# EAGLE design V3.0 (EAGLE 6.1)
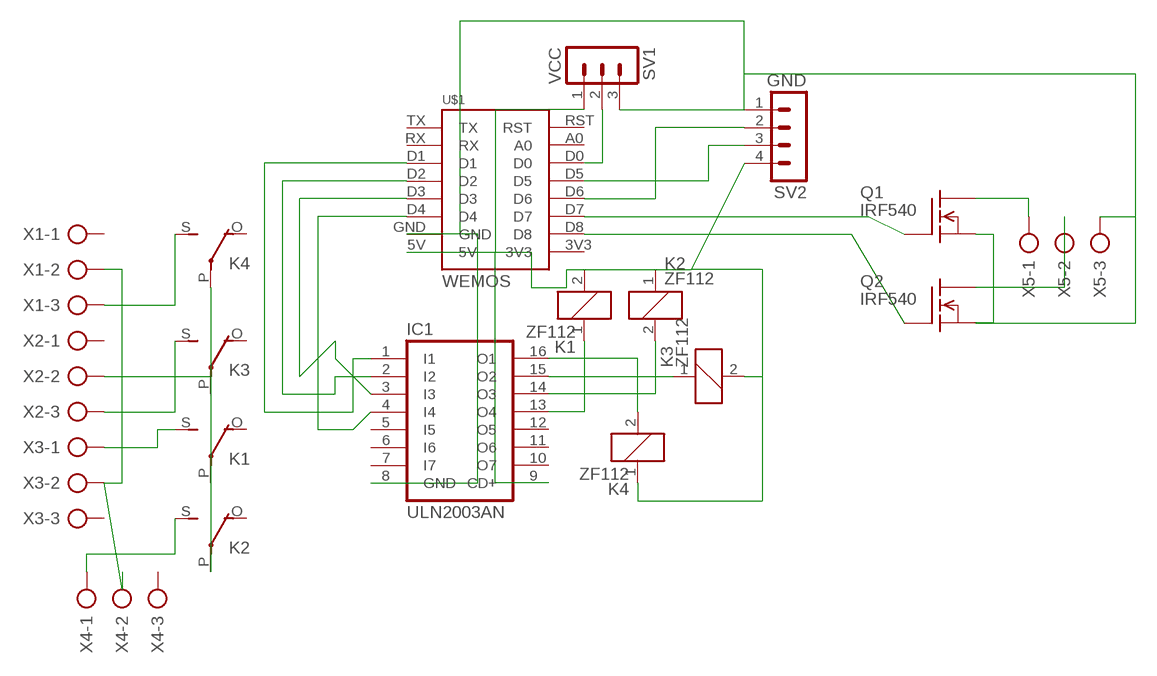
[diagram p0: schematic, sheet 1]

## Parts
IC1  ULN2003AN  [DIL16]
K1  ZF112  [ZF112]
K2  ZF112  [ZF112]
K3  ZF112  [ZF112]
K4  ZF112  [ZF112]
Q1  IRF540  [TO220]
Q2  IRF540  [TO220]
SV1  VCC  MA03-1  [MA03-1]
SV2  GND  MA04-1  [MA04-1]
U$1  WEMOS  [WEMOS]
X1  AK300/3  [AK300/3]
X2  AK300/3  [AK300/3]
X3  AK300/3  [AK300/3]
X4  AK300/3  [AK300/3]
X5  AK300/3  [AK300/3]

## Nets
N$1: IC1.1(I1) U$1.D1
N$2: IC1.2(I2) U$1.D2
N$3: IC1.3(I3) U$1.D3
N$4: IC1.4(I4) U$1.D4
N$5: IC1.8(GND) Q1.3(S) Q2.3(S) SV1.3 SV2.1 U$1.GND X5.3
N$6: IC1.9(CD+) K1.2 K2.1 K3.2 K4.1 SV1.1 SV2.4 U$1.5V
N$7: IC1.15(O2) K3.1
N$8: IC1.13(O4) K1.1
N$9: IC1.14(O3) K2.2
N$10: IC1.16(O1) K4.2
N$12: K4.S(2:S) X1.3
N$13: K3.S(2:S) X2.3
N$14: K1.S(2:S) X3.1
N$15: K2.S(2:S) X4.1
N$16: K1.P(2:P) K2.P(2:P) K3.P(2:P) K4.P(2:P) X1.2 X2.2 X3.2 X4.2
N$17: SV1.2 U$1.D0
N$19: SV2.3 U$1.D5
N$20: SV2.2 U$1.D6
N$21: Q1.1(G) U$1.D7
N$22: Q2.1(G) U$1.D8
N$24: Q1.2(D) X5.1
N$25: Q2.2(D) X5.2
Unconnected: IC1.5(I5) IC1.6(I6) IC1.7(I7) IC1.10(O7) IC1.11(O6) IC1.12(O5) K1.O(2:O) K2.O(2:O) K3.O(2:O) K4.O(2:O) U$1.3V3 U$1.A0 U$1.RST U$1.RX U$1.TX X1.1 X2.1 X3.3 X4.3

## Library data of the parts
IC1 = uln-udn:ULN2003A: DRIVER ARRAY
K1-K4 = relay:ZF112: RELAY 1 x switch; OC_FARNELL: unknown; OC_NEWARK: unknown
Q1 Q2 = transistor-fet:IRF540: N-Channel Enhancement MOSFET (HEXFET); 100V; 28A; 0,077Ohm
SV1 = con-lstb:MA03-1: PIN HEADER; OC_FARNELL: unknown; OC_NEWARK: unknown
SV2 = con-lstb:MA04-1: PIN HEADER; OC_FARNELL: unknown; OC_NEWARK: unknown
U$1 = Wemos:WEMOS
X1-X5 = con-ptr500:AK300/3: CONNECTOR; OC_FARNELL: unknown; OC_NEWARK: unknown

## Board
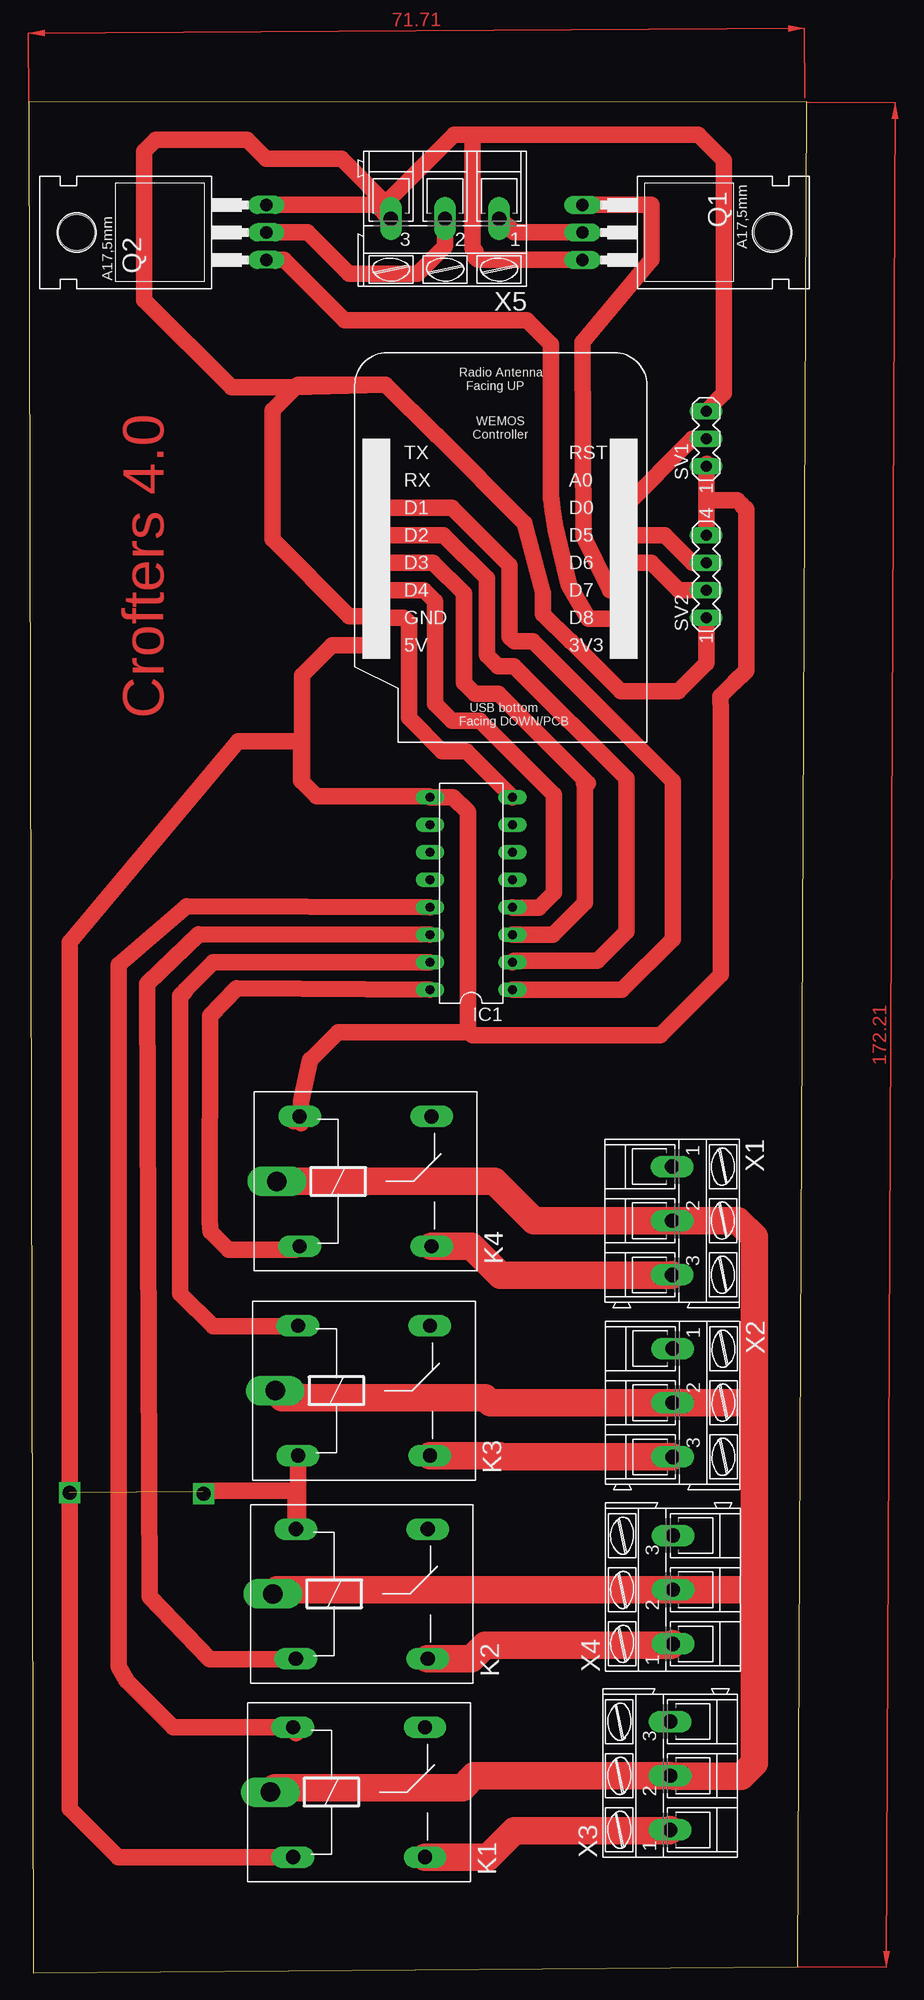
[diagram p1: board, top side]

Size 71.86 x 172.82 mm. Coordinates in mm from the lower left corner, seen from the top.
Outline: 0.38,0 71.05,0.56 71.86,172.82 0,172.75 0.38,0
Copper layers (1*16): Top 0.035mm / dielectric 1.5mm / Bottom 0.035mm
Design rules: minimum track width 60mil, minimum drill 24mil, track to track 20mil, track to pad 25mil, pad to pad 8mil, via to via 8mil, smd to smd 8mil, copper to edge 40mil, drill to drill 8mil, minimum pad ring 10mil, minimum via ring 8mil, stop-mask expansion 4mil, vias tented up to drill 0mil, thermal gap 10mil

### Footprints (pad centres in the part's own frame; a part is rotated, then mirrored left to right if it is on the bottom)
DIL16 = drill 0.813 long: 1 -8.89,-3.81; 2 -6.35,-3.81; 3 -3.81,-3.81; 4 -1.27,-3.81; 5 1.27,-3.81; 6 3.81,-3.81; 7 6.35,-3.81; 8 8.89,-3.81; 9 8.89,3.81; 10 6.35,3.81; 11 3.81,3.81; 12 1.27,3.81; 13 -1.27,3.81; 14 -3.81,3.81; 15 -6.35,3.81; 16 -8.89,3.81
ZF112 = drill 1.321 long: 1 -6.096,5.994; 2 -6.096,-5.994; O 6.096,5.994; S 6.096,-5.994 | drill 1.803 long: P -8.204,0
TO220 = drill 1.118 long: 1 -2.54,-6.35; 2 0,-6.35; 3 2.54,-6.35 | hole 3.302: 0,11.176
MA03-1 = drill 1.016 long: 1 -2.54,0; 2 0,0; 3 2.54,0
MA04-1 = drill 1.016 long: 1 -3.81,0; 2 -1.27,0; 3 1.27,0; 4 3.81,0
WEMOS = drill 0.8 octagon: 3V3 22.86,0; 5V 0,0; A0 22.86,15.24; D0 22.86,12.7; D1 0,12.7; D2 0,10.16; D3 0,7.62; D4 0,5.08; D5 22.86,10.16; D6 22.86,7.62; D7 22.86,5.08; D8 22.86,2.54; GND 0,2.54; RST 22.86,17.78; RX 0,15.24; TX 0,17.78
AK300/3 = drill 1.321 long: 1 -5.004,0; 2 0,0; 3 5.004,0

### Placement (x,y rotation side)
IC1  40.87,99.69 90 top
K1  30.51,16.69 0 top
K2  30.76,35 0 top
K3  30.96,53.77 0 top
K4  31.11,73.1 0 top
Q1  57.51,160.73 270 top
Q2  15.6,160.73 90 top
SV1  62.59,141.68 90 top
SV2  62.59,128.98 90 top
U$1  32.11,122.63 0 top
X1  59.44,69.47 270 top
X2  59.49,52.65 270 top
X3  59.26,18.21 90 top
X4  59.51,35.38 90 top
X5  38.46,162 180 top

### Tracks (layer width: path | path; a pad name or v marks a point on that pad's centre or on a via)
N$1
  Top 1.524: U$1.D1 39.09,135.33 44.42,130 44.42,123.39 44.86,122.96 46.56,122.96 59.49,110.03 59.49,95.48 54.81,90.8 IC1.1
N$2
  Top 1.524: U$1.D2 38.33,132.79 42.34,128.78 42.34,121.69 43.36,120.68 44.83,120.68 55.19,110.31 55.19,96.14 52.55,93.5 44.83,93.5 IC1.2
N$3
  Top 1.524: U$1.D3 37.36,130.25 40.18,127.43 40.18,119.15 41.2,118.14 43.41,118.14 51.66,109.88 51.64,109.85 51.61,109.88 51.31,109.88 51.38,109.8 51.46,109.88 51.49,109.88 51.38,109.78 51.38,98.83 48.44,95.88 IC1.3
N$4
  Top 1.524: U$1.D4 36.52,127.71 37.54,126.7 37.54,117.2 39.12,115.62 41.68,115.62 48.51,108.79 48.51,99.75 47.14,98.37 44.73,98.37 IC1.4
N$5
  Top 1.524: Q2.3 32.11,163.27 33.38,162 X5.3 | 62.71,125.04 SV2.1 62.59,120.95 59.99,118.36 54.69,118.36 50.09,122.96 50.04,122.96 47.52,125.48 47.52,127.46 45.8,133.88 37.69,141.99 37.64,141.99 32.94,146.68 | IC1.8 40.44,112.83 38.18,112.83 35.1,115.9 35.1,124.69 34.62,125.17 U$1.GND 32.41,124.87 32.51,124.87 32.46,124.82 32.31,124.82 31.83,125.3 29.59,125.3 22.5,132.38 22.5,144.32 24.87,146.68 32.94,146.68 | 32.94,146.68 24.41,146.43 18.72,146.43 10.67,154.48 10.67,168.25 11.73,169.32 20.14,169.32 21.92,167.54 28.88,167.54 33.71,162.71 33.71,162.26 X5.3 | X5.3 33.45,163.93 39.29,169.77 41.35,169.77 | 41.35,169.77 61.87,169.77 64.24,167.41 64.24,145.87 SV1.3 | Q1.3 41.5,158.19 41.27,158.42 41.27,158.98 40.97,159.28 40.97,169.39 41.35,169.77
N$6  (via drill 1.3)  (1 unrouted)
  Top 1.524: 24.46,78.66 24.99,78.66 25.17,78.49 25.17,78.94 | 25.17,78.94 K4.1 | SV2.4 62.59,135.89 | 62.59,135.89 62.59,138.84 62.61,138.86 62.61,139.17 | 62.66,139.4 62.61,139.34 62.61,139.17 | U$1.5V 28.02,122.63 25.22,119.84 25.22,110.01 | 25.22,110.01 26.57,108.66 36.98,108.66 IC1.9 39.19,108.58 40.56,107.21 40.56,87.02 40.69,86.89 | 40.69,86.89 40.97,86.61 58.34,86.61 63.93,92.2 63.93,116.46 63.88,117.91 65.15,119.13 66.29,120.27 66.29,135.15 65.89,135.56 65.89,135.59 65.46,136.02 62.71,136.02 62.59,135.89 | K1.2 8.25,10.69 3.78,15.16 v3.78,44.35 3.78,95.17 19.35,113.74 24.94,113.74 | 24.94,113.74 25.15,113.94 | 25.17,78.94 25.17,80.52 25.98,84.33 26.01,84.33 28.57,86.89 40.69,86.89 | K3.2 24.87,41.2 K2.1 24.66,44.48 24.71,44.53 16.15,44.53 16.05,44.42 | 24.94,113.74 24.94,113.77 25.07,113.77 25.07,113.64 25.09,113.64 25.15,113.69 25.15,110.19 25.27,110.06 25.25,110.06 | 25.25,110.06 25.22,110.06 25.17,110.11 25.2,110.11 25.25,110.06 | 25.25,110.06 25.25,110.03 25.27,110.01 25.22,110.01 | 62.61,139.17 SV1.1
N$7
  Top 1.524: IC1.15 17.02,93.34 14.43,90.75 14.43,90.65 14,90.22 14,62.74 17.02,59.72 24.92,59.72 24.97,59.77 | K3.1 24.97,59.77 | 24.97,59.77 25.02,59.82
N$8
  Top 1.524: IC1.13 14.58,98.5 8.28,93.09 8.28,28.27 9.04,26.97 13.33,22.68 24.16,22.68 24.69,22.15 24.69,22.4 K1.1
N$9
  Top 1.524: IC1.14 15.7,95.91 10.92,91.36 11.15,34.75 16.69,28.98 24.64,28.98 K2.2
N$10
  Top 1.524: K4.2 24.69,66.78 18.47,66.78 16.8,68.44 16.71,69.42 16.74,88.39 19.2,90.96 IC1.16
N$11  (via drill 1.3)
  other vias: 16.15,44.25
N$12
  Top 2.54: K4.S 40.92,67.11 43.59,64.44 59.41,64.44 X1.3
N$13
  Top 1.524: X2.3 58.98,47.65
  Top 2.54: K3.S 43.54,47.78 43.66,47.65 58.98,47.65 59.41,47.65
N$14
  Top 2.54: K1.S 42.44,10.69 44.88,13.13 59.18,13.13 X3.1
N$15
  Top 2.54: K2.S 40.92,29.01 42.16,30.25 59.38,30.25 X4.1
N$16
  Top 1.524: 59.61,18.16 59.38,17.93 59.38,18.16 59.36,18.19 | 59.33,18.21 59.13,18.41 59.13,18.21 | 59.28,18.21 59.33,18.21 | 59.33,18.21 59.36,18.19 | 59.36,18.19 59.31,18.19 59.28,18.21 | 59.28,18.21 X3.2
  Top 2.54: K4.P 22.94,73.13 43.03,73.13 46.68,69.47 X1.2 65.53,69.47 67.03,67.97 67.03,52.68 | K3.P 23.39,53.14 42.16,53.14 42.65,52.65 X2.2 67,52.65 67.03,52.68 | K2.P 22.94,35.38 X4.2 66.98,35.38 67.03,35.33 | X3.2 59.23,18.21 59.13,18.21 41.15,18.21 40.06,17.12 22.73,17.12 K1.P | 67.03,52.68 67.03,35.33 | 67.03,35.33 67.03,19.35 65.84,18.16 59.61,18.16
N$17
  Top 1.524: U$1.D0 61.32,141.68 SV1.2
N$19
  Top 1.524: U$1.D5 58.78,132.79 61.32,130.25 SV2.3
N$20
  Top 1.524: U$1.D6 57.51,130.25 60.05,127.71 SV2.2
N$21
  Top 1.524: U$1.D7 53.7,127.71 51.23,132.66 51.16,150.57 57.51,158.19 57.51,163.27 Q1.1
N$22
  Top 1.524: Q2.1 23.6,158.19 29.16,152.63 46.02,152.63 48.26,150.39 48.26,136.22 48.29,136.04 48.36,135.15 48.67,133.4 49.89,128.14 51.71,125.04 54.84,125.04 U$1.D8
N$24
  Top 1.524: Q1.2 44.81,160.73 43.54,162 X5.1
N$25
  Top 1.524: Q2.2 25.76,160.73 29.57,156.92 35.92,156.92 38.46,159.46 X5.2
(copper drawn outside any net)
  shapes: Top area x2

### Text on the board
Top: Crofters 4.0